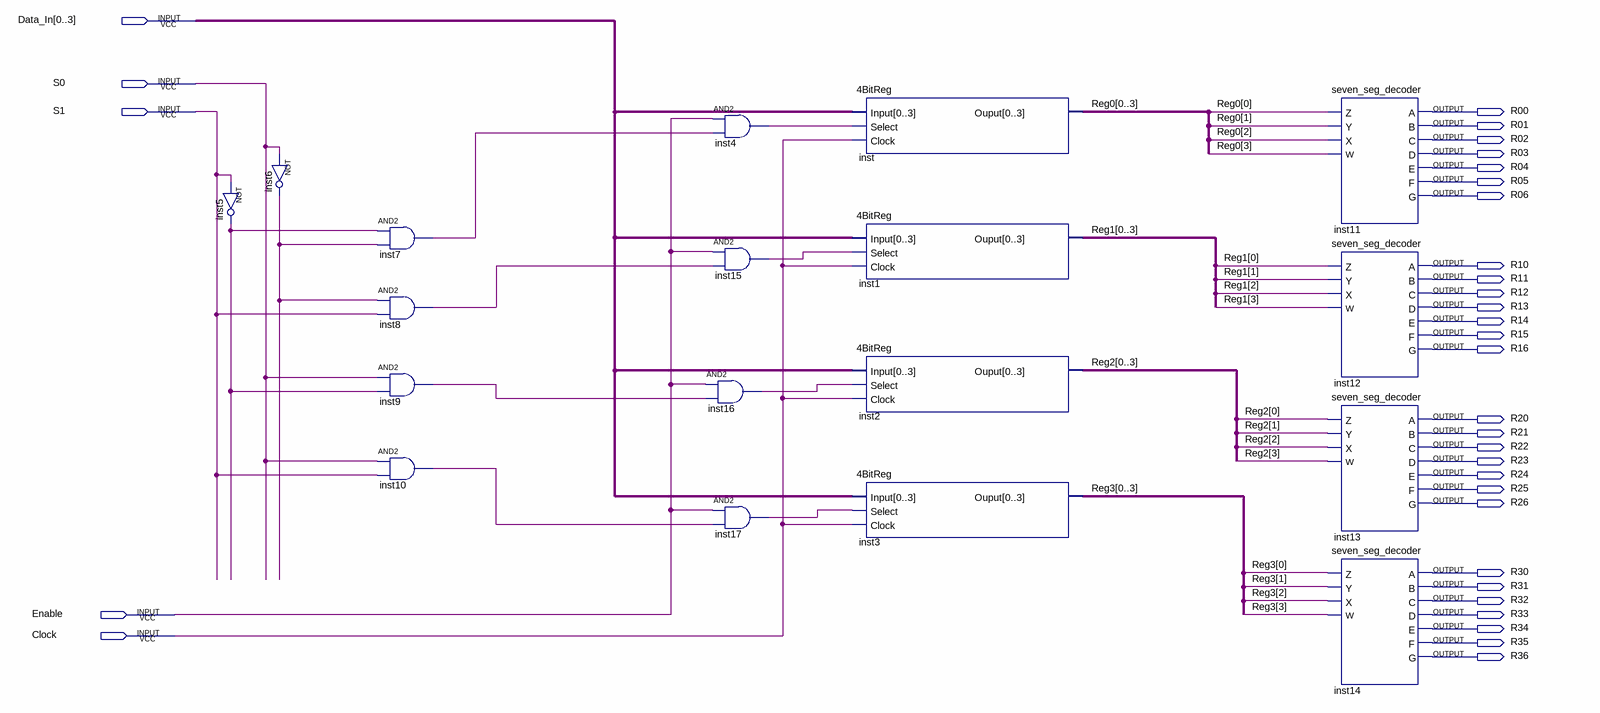
[diagram p0: schematic sheet]
// Quartus schematic memAssign.bdf as structural Verilog: 18 symbols, 33 pins
module memAssign (
  input  [0:3] Data_In,
  input  S0,
  input  S1,
  input  Enable,
  input  Clock,
  output R00,
  output R01,
  output R02,
  output R03,
  output R04,
  output R05,
  output R06,
  output R10,
  output R11,
  output R12,
  output R13,
  output R14,
  output R15,
  output R16,
  output R20,
  output R21,
  output R22,
  output R23,
  output R24,
  output R25,
  output R26,
  output R30,
  output R31,
  output R32,
  output R33,
  output R34,
  output R35,
  output R36
);

  wire inst4_out, inst5_out, inst6_out, inst7_out, inst8_out, inst9_out, inst10_out, inst15_out, inst16_out,
       inst17_out;
  wire [3:0] Reg0, Reg1, Reg2, Reg3;

  not inst5 (inst5_out, S1);
  not inst6 (inst6_out, S0);
  and inst7 (inst7_out, inst5_out, inst6_out);
  and inst8 (inst8_out, inst6_out, S1);
  and inst9 (inst9_out, S0, inst5_out);
  and inst10 (inst10_out, S0, S1);
  and inst16 (inst16_out, Enable, inst9_out);
  and inst4 (inst4_out, Enable, inst7_out);
  and inst15 (inst15_out, Enable, inst8_out);
  and inst17 (inst17_out, Enable, inst10_out);
  \4BitReg  inst (.Input(Data_In), .Select(inst4_out), .Clock(Clock), .Ouput({Reg0[0], Reg0[1], Reg0[2], Reg0[3]}));
  \4BitReg  inst1 (.Input(Data_In), .Select(inst15_out), .Clock(Clock), .Ouput({Reg1[0], Reg1[1], Reg1[2], Reg1[3]}));
  \4BitReg  inst2 (.Input(Data_In), .Select(inst16_out), .Clock(Clock), .Ouput({Reg2[0], Reg2[1], Reg2[2], Reg2[3]}));
  \4BitReg  inst3 (.Input(Data_In), .Select(inst17_out), .Clock(Clock), .Ouput({Reg3[0], Reg3[1], Reg3[2], Reg3[3]}));
  seven_seg_decoder inst11 (
    .Z(Reg0[0]), .Y(Reg0[1]), .X(Reg0[2]), .W(Reg0[3]), .A(R00), .B(R01), .C(R02), .D(R03), .E(R04), .F(R05),
    .G(R06));
  seven_seg_decoder inst12 (
    .Z(Reg1[0]), .Y(Reg1[1]), .X(Reg1[2]), .W(Reg1[3]), .A(R10), .B(R11), .C(R12), .D(R13), .E(R14), .F(R15),
    .G(R16));
  seven_seg_decoder inst13 (
    .Z(Reg2[0]), .Y(Reg2[1]), .X(Reg2[2]), .W(Reg2[3]), .A(R20), .B(R21), .C(R22), .D(R23), .E(R24), .F(R25),
    .G(R26));
  seven_seg_decoder inst14 (
    .Z(Reg3[0]), .Y(Reg3[1]), .X(Reg3[2]), .W(Reg3[3]), .A(R30), .B(R31), .C(R32), .D(R33), .E(R34), .F(R35),
    .G(R36));
endmodule
